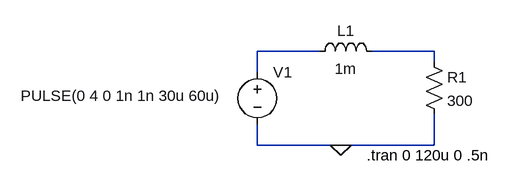
[diagram p0: schematic Exp3Part1c2.asc]
Exp3Part1c2.asc, the LTspice schematic file:
Version 4
SHEET 1 880 680
WIRE 112 32 16 32
WIRE 288 32 192 32
WIRE 288 48 288 32
WIRE 16 64 16 32
WIRE 16 176 16 144
WIRE 144 176 16 176
WIRE 288 176 288 128
WIRE 288 176 144 176
FLAG 144 176 0
SYMBOL res 272 32 R0
SYMATTR InstName R1
SYMATTR Value 300
SYMBOL ind 96 48 R270
WINDOW 0 32 56 VTop 2
WINDOW 3 5 56 VBottom 2
SYMATTR InstName L1
SYMATTR Value 1m
SYMBOL voltage 16 48 R0
WINDOW 123 -98 52 Left 2
WINDOW 39 0 0 Left 0
WINDOW 3 -364 52 Left 2
SYMATTR InstName V1
SYMATTR Value PULSE(0 4 0 1n 1n 30u 60u)
TEXT 184 192 Left 2 !.tran 0 120u 0 .5n

The netlist it stands for:
* Exp3Part1c2.asc
R1 N002 0 300
L1 N001 N002 1m
V1 N001 0 PULSE(0 4 0 1n 1n 30u 60u)
.tran 0 120u 0 .5n
.backanno
.end